# EAGLE design EXP430G2_node (EAGLE 8.2.2)
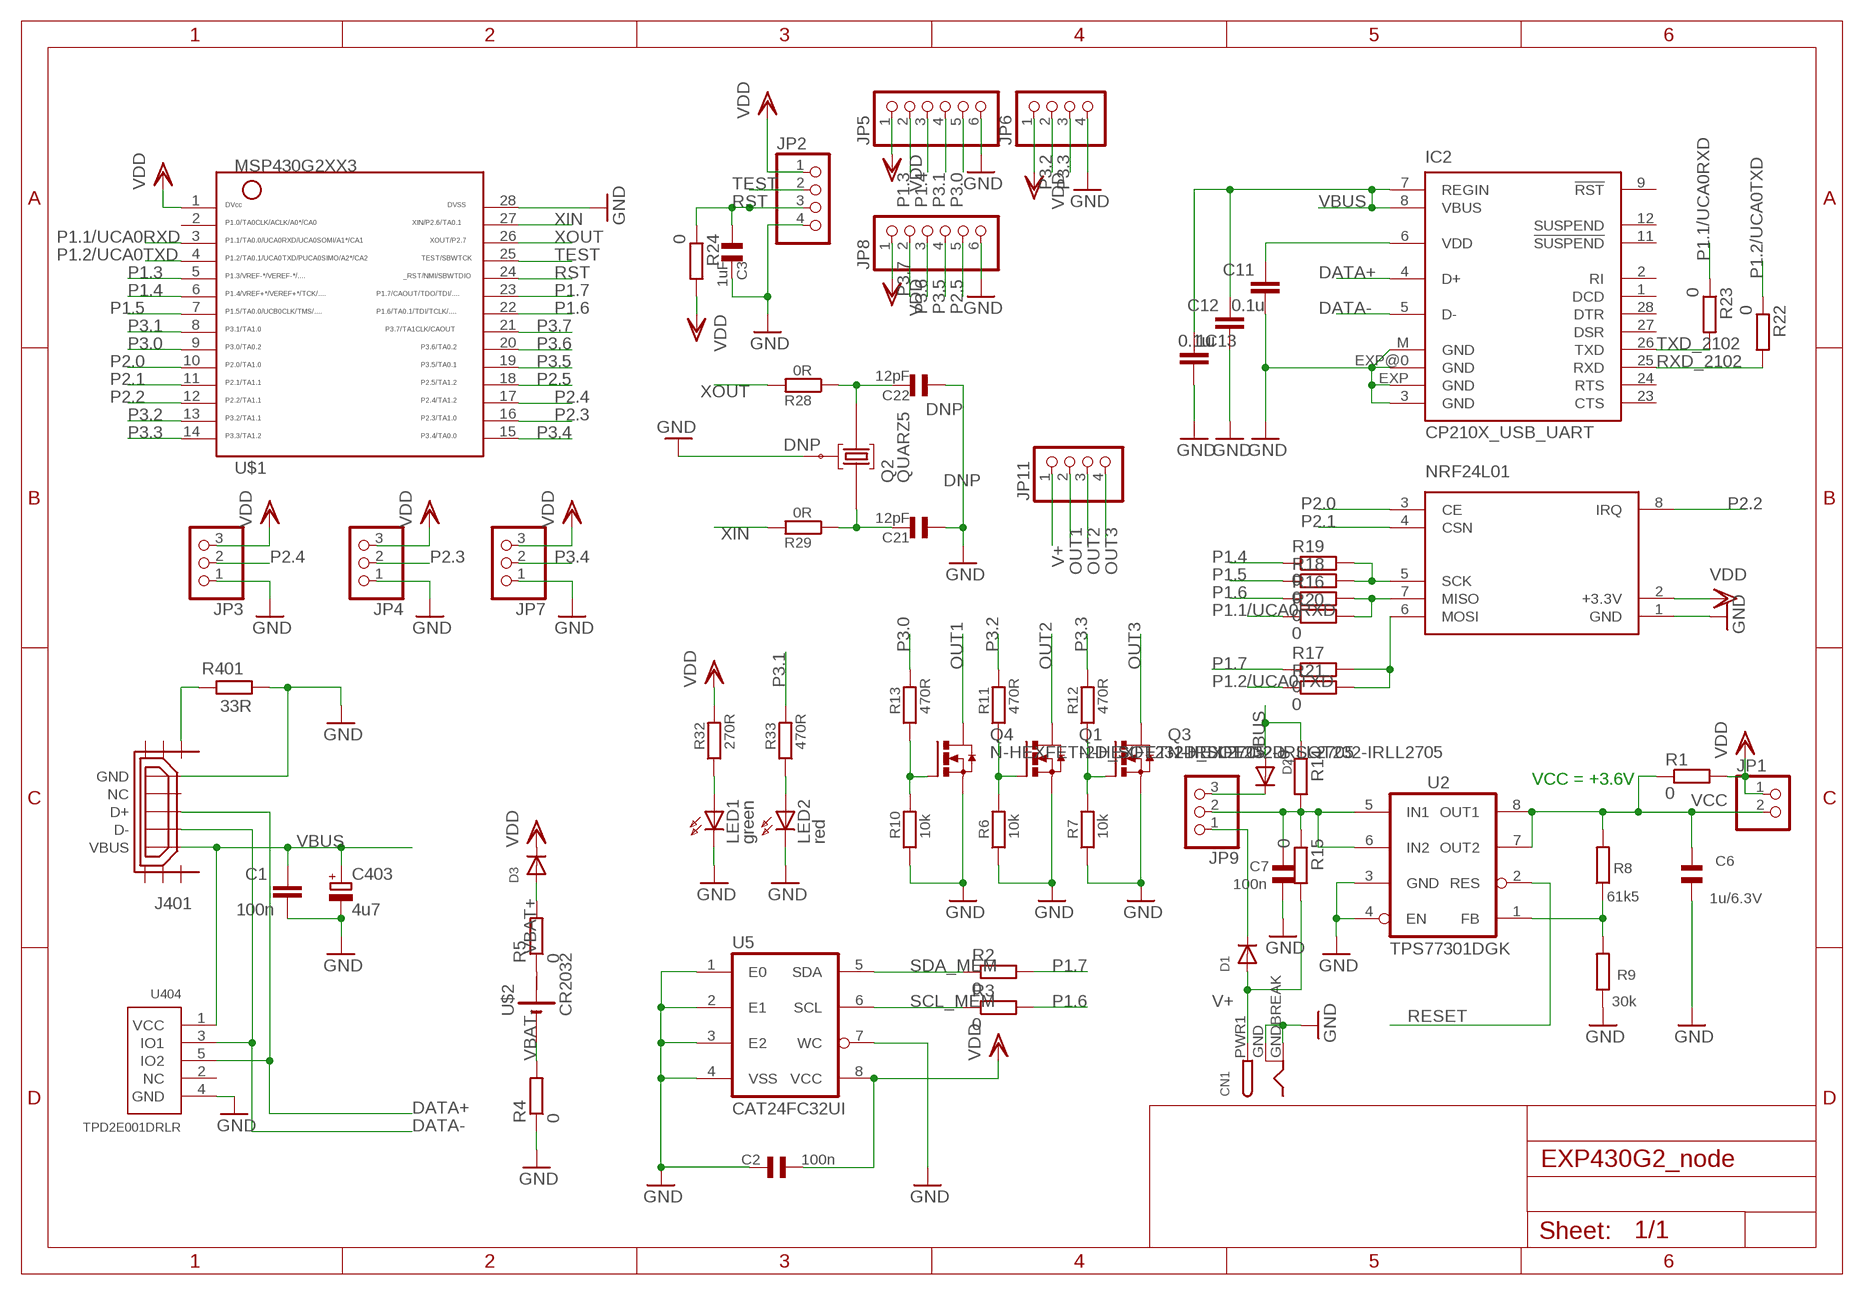
[diagram p0: schematic, sheet 1]

## Parts
C1  100n  C-EUC0603  [C0603]
C2  100n  C_SMD0603  [0603]
C3  1uF  C_SMD0603  [0603]
C6  1u/6.3V  C_SMD0603  [0603]
C7  100n  C_SMD0603  [0603]
C11  0.1u  C-EUC0603  [C0603]
C12  1u  C-EUC0603  [C0603]
C13  0.1u  C-EUC0603  [C0603]
C21  12pF  C_SMD0603  [0603]
C22  12pF  C_SMD0603  [0603]
C403  4u7  CPOL-EUA/3216-18R  [A/3216-18R]
CN1  DCBARRELSMT  [DCJACK_2MM_SMT]
D1  DIODESOT23_REFLOW  [SOT23-R]
D2  DIODESOT23_REFLOW  [SOT23-R]
D3  DIODESOT23_REFLOW  [SOT23-R]
IC2  CP210X_USB_UART  [MLP28]
J401  USB_MICRO_FLIPPED  [HIROSE-ZX62R-B-5P]
JP1  PINHD-1X2  [1X02]
JP2  PINHD-1X4  [1X04]
JP3  PINHD-1X3  [1X03]
JP4  PINHD-1X3_2.00  [1X03M]
JP5  PINHD-1X6_2.00  [1X06M]
JP6  PINHD-1X4_2.00  [1X04M]
JP7  PINHD-1X3  [1X03]
JP8  PINHD-1X6_2.00  [1X06M]
JP9  PINHD-1X3  [1X03]
JP11  PINHD-1X4_2.00  [1X04M]
LED1  green  LED_0603D0603  [DIODE0603]
LED2  red  LED_0603D0603  [DIODE0603]
NRF24L01  NRF24L01HP  [NRF24L01_HP]
Q1  N-HEXFET-2D_SOT232-IRLL2705  [SOT223]
Q2  QUARZ5  [QUARZ5]
Q3  N-HEXFET-2D_SOT232-IRLL2705  [SOT223]
Q4  N-HEXFET-2D_SOT232-IRLL2705  [SOT223]
R1  0  R-EU_R0201  [R0201]
R2  0  R-EU_R0201  [R0201]
R3  0  R-EU_R0201  [R0201]
R4  0  R-EU_R0201  [R0201]
R5  0  R-EU_R0201  [R0201]
R6  10k  R_SMDR0603  [0603]
R7  10k  R_SMDR0603  [0603]
R8  61k5  R_SMDR0603  [0603]
R9  30k  R_SMDR0603  [0603]
R10  10k  R_SMDR0603  [0603]
R11  470R  R_SMDR0603  [0603]
R12  470R  R_SMDR0603  [0603]
R13  470R  R_SMDR0603  [0603]
R14  0  R-EU_R0201  [R0201]
R15  0  R-EU_R0201  [R0201]
R16  0  R-EU_R0201  [R0201]
R17  0  R-EU_R0201  [R0201]
R18  0  R-EU_R0201  [R0201]
R19  0  R-EU_R0201  [R0201]
R20  0  R-EU_R0201  [R0201]
R21  0  R-EU_R0201  [R0201]
R22  0  R-EU_R0201  [R0201]
R23  0  R-EU_R0201  [R0201]
R24  0  R-EU_R0201  [R0201]
R28  0R  R_SMDR0603  [0603]
R29  0R  R_SMDR0603  [0603]
R32  270R  R_SMDR0603  [0603]
R33  470R  R_SMDR0603  [0603]
R401  33R  R-EU_R0603  [R0603]
U2  TPS77301DGK  TPS773XX  [MSOP8]
U5  CAT24FC32UI  M24XXX  [TSSOP8]
U404  TPD2E001DRLR  TPD2E001  [TPD2E001-DRL]
U$1  G2XX3---PW28  [PW28]
U$2  CR2032  [CR2032]

## Nets
DATA+: IC2.4(D+) J401.D+ U404.5(IO2)
DATA-: IC2.5(D-) J401.D- U404.3(IO1)
GND [Ground]: C1.2 C2.2 C3.2 C6.2 C7.1 C11.2 C12.2 C13.2 C21.1 C22.1 C403.- CN1.GND(GNDBREAK) CN1.GNDBREAK(GND) IC2.3(GND) IC2.EXP(GND) IC2.EXP@0(GND) IC2.M(GND) J401.GND JP2.4 JP3.1 JP4.1 JP5.6 JP6.4 JP7.1 JP8.6 LED1.K(C) LED2.K(C) NRF24L01.1(GND) Q1.3(S) Q2.GND@0 Q3.3(S) Q4.3(S) R4.1 R6.1 R7.1 R9.1 R10.1 R401.2 U2.3(GND) U2.4(EN) U5.1(E0) U5.2(E1) U5.3(E2) U5.4(VSS) U5.7(WC) U404.4(GND) U$1.28
N$1: C7.2 JP9.2 R14.2 R15.1 U2.5(IN1) U2.6(IN2)
N$2: D1.3(C) JP9.1
N$4: R8.1 R9.2 U2.1(FB)
N$5: D3.1(A) R5.2
N$6: Q1.1(G) R6.2 R11.1
N$7: NRF24L01.7(MISO) R16.2 R20.2
N$8: Q3.1(G) R7.2 R12.1
N$9: NRF24L01.6(MOSI) R17.2 R21.2
N$10: J401.SHIELD1 R401.1
N$11: Q4.1(G) R10.2 R13.1
N$12: NRF24L01.5(SCK) R18.2 R19.2
N$14: LED2.A R33.1
N$20: C11.1 IC2.6(VDD)
N$34: LED1.A R32.1
OUT1: JP11.2 Q4.2(D) Q4.4(D)
OUT2: JP11.3 Q1.2(D) Q1.4(D)
OUT3: JP11.4 Q3.2(D) Q3.4(D)
P1.1/UCA0RXD: R20.1 R23.1 U$1.3
P1.2/UCA0TXD: R21.1 R22.1 U$1.4
P1.3: JP5.2 U$1.5
P1.4: JP5.3 R19.1 U$1.6
P1.5: R18.1 U$1.7
P1.6: R3.2 R16.1 U$1.22
P1.7: R2.2 R17.1 U$1.23
P2.0: NRF24L01.3(CE) U$1.10
P2.1: NRF24L01.4(CSN) U$1.11
P2.2: NRF24L01.8(IRQ) U$1.12
P2.3: JP4.2 U$1.16
P2.4: JP3.2 U$1.17
P2.5: JP8.5 U$1.18
P3.0: JP5.5 R13.2 U$1.9
P3.1: JP5.4 R33.2 U$1.8
P3.2: JP6.2 R11.2 U$1.13
P3.3: JP6.3 R12.2 U$1.14
P3.4: JP7.2 U$1.15
P3.5: JP8.4 U$1.19
P3.6: JP8.3 U$1.20
P3.7: JP8.2 U$1.21
RESET: U2.2(RES)
RST: C3.1 JP2.3 R24.1 U$1.24
RXD_2102: IC2.25(RXD) R22.2
SCL_MEM: R3.1 U5.6(SCL)
SDA_MEM: R2.1 U5.5(SDA)
TEST: JP2.2 U$1.25
TXD_2102: IC2.26(TXD) R23.2
V+: CN1.PWR1(PWR) D1.1(A) JP11.1 R15.2
VBAT+: R5.1 U$2.P$1(+)
VBAT-: R4.2 U$2.P$2(-)
VBUS [Power]: C1.1 C12.1 C13.1 C403.+ D2.1(A) IC2.7(REGIN) IC2.8(VBUS) J401.VBUS R14.1 U404.1(VCC)
VBUS+ [Power]: D2.3(C) JP9.3
VCC: C6.1 JP1.2 R1.1 R8.2 U2.7(OUT2) U2.8(OUT1)
VDD: C2.1 D3.3(C) JP1.1 JP2.1 JP3.3 JP4.3 JP5.1 JP6.1 JP7.3 JP8.1 NRF24L01.2(+3.3V) R1.2 R24.2 R32.2 U5.8(VCC) U$1.1
XIN: R29.2 U$1.27
XINR: C21.2 Q2.2 R29.1
XOUT: R28.2 U$1.26
XOUTR: C22.2 Q2.1 R28.1
Unconnected: IC2.1(DCD) IC2.2(RI) IC2.9(!RST) IC2.11(!SUSPEND) IC2.12(SUSPEND) IC2.23(CTS) IC2.24(RTS) IC2.27(DSR) IC2.28(DTR) J401.NC J401.SHIELD2 J401.SHIELD3 J401.SHIELD4 J401.SHIELD5 J401.SHIELD6 U404.2(NC) U$1.2

## Notes on the sheet
- DNP
- DNP
- DNP
- VCC = +3.6V

## Library data of the parts
C1 C11-C13 = rcl:C-EU: CAPACITOR, European symbol
C2 C6 C7 = smd:C_SMD
C3 C21 C22 = ssmd:C_SMD
C403 = rcl:CPOL-EU: POLARIZED CAPACITOR, European symbol
CN1 = adafruit:DCBARREL: 2.0mm DC Barrel Jack DCJACK_2MM_PTH - Through Hole Jack (4UConnector: 05537)
D1-D3 = adafruit:DIODE: Diode SMADIODE - SMA Surface Mount Package 20V 1A Schottky Diode Digikey: 641-1014-6-ND DO-1N4148 - Through Hole Small Current Diode SOD-123 20V 1 A (.5mV Vf) Schottky Diode - Digikey: MBRX120TPMSCT-ND SOD-323 10V 570mA (.38mV Vf, 3ns) Schottky Diode - Digikey: ZLLS410CT-ND SOD-523 30V 30mA Schottky Diode (RB751S-40TE61) - Digikey: RB751S-40TE61CT-ND SOT23-R/W - SOT23 Package (R = Solder Paste/Reflow Ovens, W = Hand-Soldering) BAT54Film 40V 300mA - Digikey: 497-7162-1-ND
IC2 = SparkFun:CP210X_USB_UART: Single-Chip USB to UART Bridge Source: www.silabs.com .. CP2101.pdf / cp2102.pdf. Spark Fun Electronics SKU : COM-00310
J401 = usb_con-update:USB_MICRO_FLIPPED
JP1 = pinhead:PINHD-1X2: PIN HEADER
JP2 = pinhead:PINHD-1X4: PIN HEADER
JP3 = pinhead:PINHD-1X3: PIN HEADER
JP4 = pinhead_smd:PINHD-1X3: PIN HEADER
JP5 JP8 = pinhead_smd:PINHD-1X6: PIN HEADER
JP6 JP11 = pinhead_smd:PINHD-1X4: PIN HEADER
JP7 JP9 = adafruit:PINHD-1X3: PIN HEADER
LED1 LED2 = smd:LED_0603
NRF24L01 = jt-raspberry-pi:NRF24L01
Q1 Q3 Q4 = transistor-power:N-HEXFET-2D_?-*: HEXFET® Power MOSFET 2 Drain connects http://www.irf.com/product-info/datasheets/data/irll014n.pdf
Q2 = sMSP430:QUARZ5
R1-R5 R14-R24 = resistor:R-EU_: RESISTOR, European symbol
R6 R7 R10-R13 R28 R29 R32 R33 = ssmd:R_SMD
R8 R9 = smd:R_SMD
R401 = rcl:R-EU_: RESISTOR, European symbol
U2 = gangprog:TPS773XX: VReg, 250mA
U5 = usbfet:M24XXX: Serial EEProm: 24LC xxx
U404 = Project7264:TPD2E001: TPD2E001 ESD-protection diode array
U$1 = TI_MSP430_v16:G2XX3---PW28: MSP430G2XX1 TSSOP (PW) 28 Pin Package
U$2 = jt-raspberry-pi:CR2032

## Net classes
0 default: width 0.254 mm
1 Ground: width 0.1 mm, drill 0.2 mm
2 Power: width 0.203 mm, drill 0.305 mm, clearance 0.152 mm to class 0, clearance 0.152 mm to class 1, clearance 0.152 mm

## Board
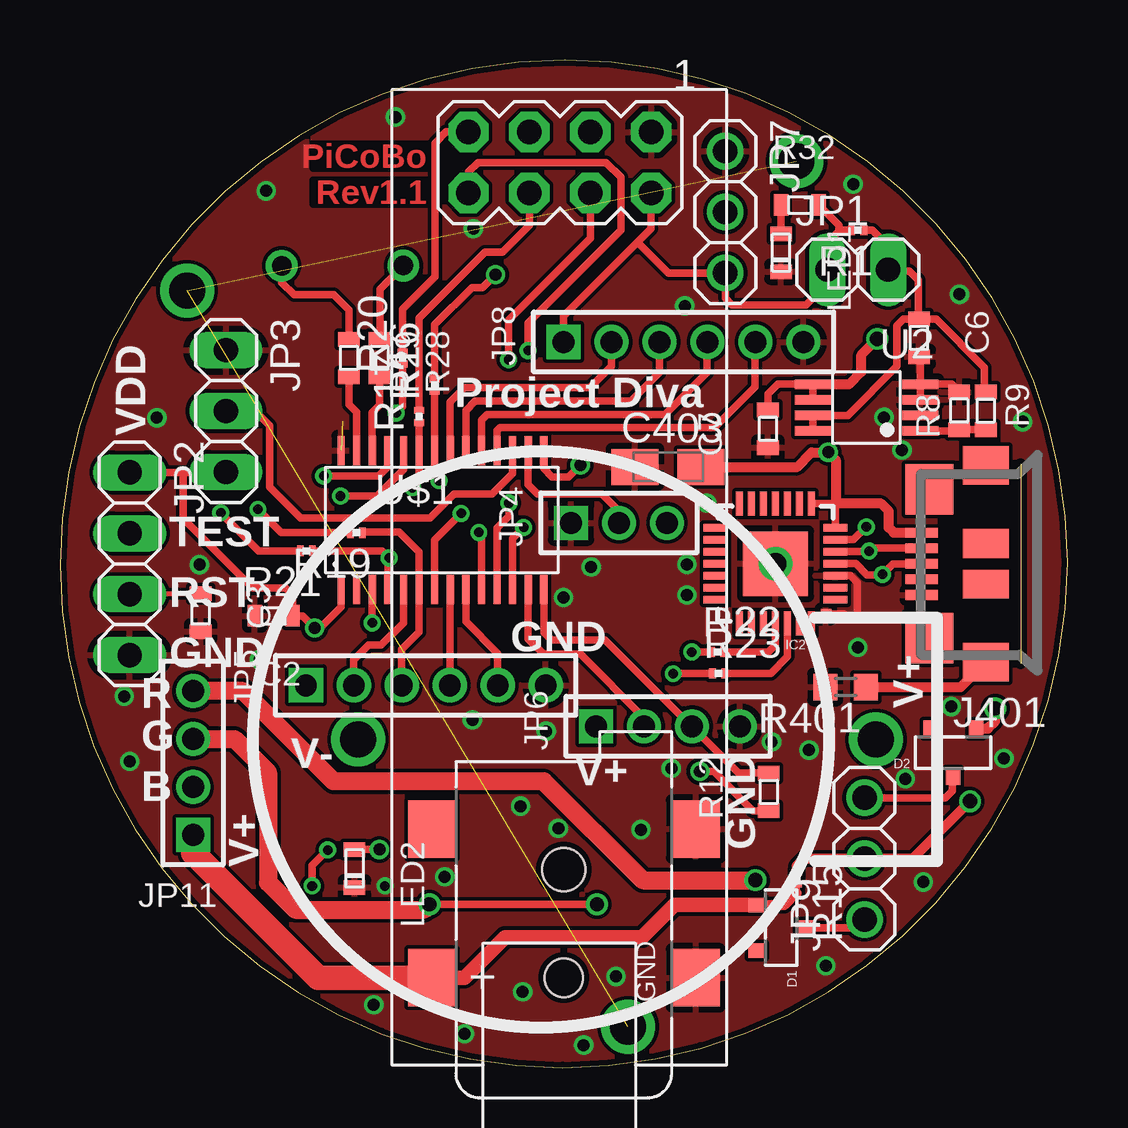
[diagram p1: board, top side]
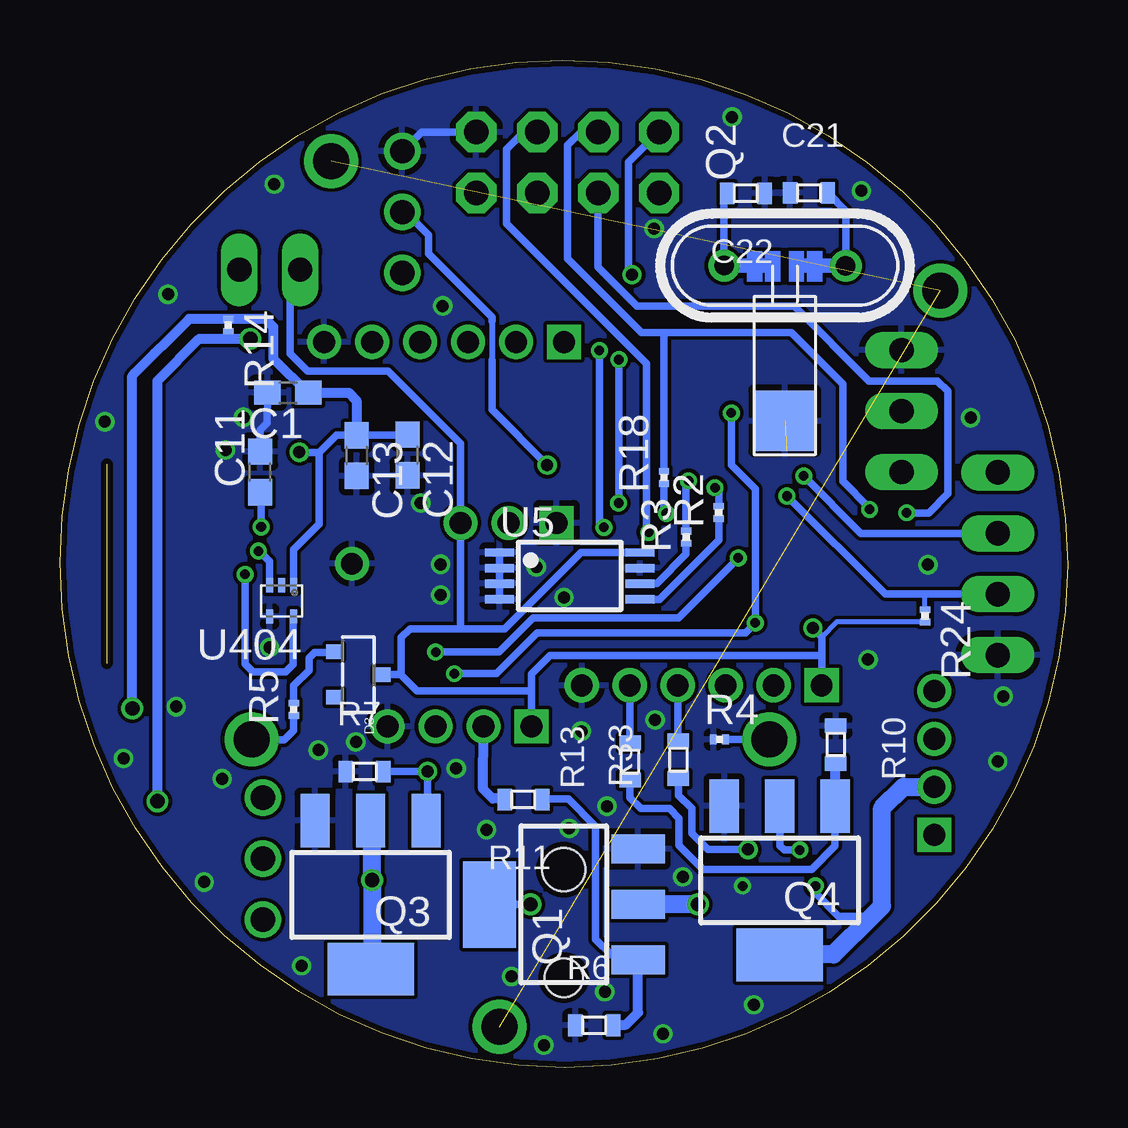
[diagram p2: board, bottom side, seen from below]

Size 42 x 42 mm. Coordinates in mm from the lower left corner, seen from the top.
Outline: 0,20.95 arc90 20.95,0 arc90 42,21.05 arc90 21.05,42 arc90 0,20.95
Copper layers (1*16): Top 0.035mm / dielectric 1.5mm / Bottom 0.035mm
Design rules "Elecrow_2-layer_eagle_rule": minimum track width 6mil, minimum drill 12mil, track to track 6mil, track to pad 6mil, pad to pad 6mil, via to via 6mil, smd to smd 0mil, copper to edge 10mil, drill to drill 10mil, minimum pad ring 10mil, minimum via ring 6mil, stop-mask expansion 2mil, vias tented up to drill 100mil, thermal gap 10mil

### Footprints (pad centres in the part's own frame; a part is rotated, then mirrored left to right if it is on the bottom)
C0603 = smd 1.1 x 1: 1 -0.85,0; 2 0.85,0
0603 = smd 0.6 x 0.9: 1 -0.787,0; 2 0.787,0
A/3216-18R = smd 1.95 x 1.5: + 1.375,0; - -1.375,0
DCJACK_2MM_SMT = smd 2.4 x 2: GND 0,-5.5; GNDBREAK 6.2,-5.5; PWR1 0,5.5; PWR2 6.2,5.5 | hole 1.6: 0,0 | hole 1.8: 4.5,0
SOT23-R = smd 0.6 x 0.7: 1 -0.95,-1; 2 0.95,-1; 3 0,1
MLP28 = smd 1 x 0.3: 1 -2.5,1.5; 2 -2.5,1; 3 -2.5,0.5; 4 -2.5,0; 5 -2.5,-0.5; 6 -2.5,-1; 7 -2.5,-1.5; 15 2.5,-1.5; 16 2.5,-1; 17 2.5,-0.5; 18 2.5,0; 19 2.5,0.5; 20 2.5,1; 21 2.5,1.5 | smd 0.3 x 1: 8 -1.5,-2.5; 9 -1,-2.5; 10 -0.5,-2.5; 11 0,-2.5; 12 0.5,-2.5; 13 1,-2.5; 14 1.5,-2.5; 22 1.5,2.5; 23 1,2.5; 24 0.5,2.5; 25 0,2.5; 26 -0.5,2.5; 27 -1,2.5; 28 -1.5,2.5 | smd 2.7 x 2.7: EXP 0,0 | drill 0.9: EXP@0 0,0 | smd 0.435 x 0.435: M -2.103,2.103
HIROSE-ZX62R-B-5P = smd 1.35 x 0.4: D+ 2.675,0; D- 2.675,-0.65; GND 2.675,1.3; NC 2.675,0.65; VBUS 2.675,-1.3 | smd 1.9 x 1.6: SHIELD1 0,4.1; SHIELD2 0,-4.1 | smd 2 x 2.1: SHIELD3 2.35,3.1; SHIELD4 2.35,-3.1 | smd 1.9 x 1.2: SHIELD5 0,0.85; SHIELD6 0,-0.85
1X02 = drill 1.016 long: 1 -1.27,0; 2 1.27,0
1X04 = drill 1.016 long: 1 -3.81,0; 2 -1.27,0; 3 1.27,0; 4 3.81,0
1X03 = drill 1.016 long: 1 -2.54,0; 2 0,0; 3 2.54,0
1X03M = drill 0.914 square: 1 -2,0 | drill 0.914: 2 0,0; 3 2,0
1X06M = drill 0.914 square: 1 -5,0 | drill 0.914: 2 -3,0; 3 -1,0; 4 1,0; 5 3,0; 6 5,0
1X04M = drill 0.914 square: 1 -3,0 | drill 0.914: 2 -1,0; 3 1,0; 4 3,0
1X03' = drill 1.016: 1 -2.54,0; 2 0,0; 3 2.54,0
DIODE0603 = smd 0.6 x 0.9: A -0.787,0; K 0.787,0
NRF24L01_HP = drill 1.016 pad 1.676 octagon: 1 13.485,-5.74; 2 10.945,-5.74; 3 13.485,-3.2; 4 10.945,-3.2; 5 13.485,-0.66; 6 10.945,-0.66; 7 13.485,1.88; 8 10.945,1.88
SOT223 = smd 1.219 x 2.235: 1 -2.311,-3.099; 2 0,-3.099; 3 2.311,-3.099 | smd 3.6 x 2.2: 4 0,3.099
QUARZ5 = drill 0.813: 1 1.53,1.773; 2 1.52,-3.303 | smd 2.54 x 2.54: GND@0 -4.941,-0.762
R0201 = smd 0.28 x 0.43: 1 -0.255,0; 2 0.255,0
R0603 = smd 1 x 1.1: 1 -0.85,0; 2 0.85,0
MSOP8 = smd 0.4 x 1.5: 1 -0.978,-2.3; 2 -0.333,-2.3; 3 0.323,-2.3; 4 0.968,-2.3; 5 0.968,2.18; 6 0.323,2.18; 7 -0.333,2.18; 8 -0.978,2.18
TSSOP8 = smd 1.2 x 0.35: 1 -2.925,0.975; 2 -2.925,0.325; 3 -2.925,-0.325; 4 -2.925,-0.975; 5 2.925,-0.975; 6 2.925,-0.325; 7 2.925,0.325; 8 2.925,0.975
TPD2E001-DRL = smd 0.3 x 0.6: 1 -0.5,-0.65; 2 0,-0.65; 3 0.5,-0.65; 4 0.5,0.65; 5 -0.5,0.65
PW28 = smd 0.3 x 1.2: 1 -4.229,-2.908; 2 -3.579,-2.908; 3 -2.929,-2.908; 4 -2.279,-2.908; 5 -1.629,-2.908; 6 -0.979,-2.908; 7 -0.329,-2.908; 8 0.321,-2.908; 9 0.971,-2.908; 10 1.621,-2.908; 11 2.271,-2.908; 12 2.921,-2.908; 13 3.571,-2.908; 14 4.221,-2.908; 15 4.221,2.892; 16 3.571,2.892; 17 2.921,2.892; 18 2.271,2.892; 19 1.621,2.892; 20 0.971,2.892; 21 0.321,2.892; 22 -0.329,2.892; 23 -0.979,2.892; 24 -1.629,2.892; 25 -2.279,2.892; 26 -2.929,2.892; 27 -3.579,2.892; 28 -4.229,2.892
CR2032 = drill 1.5: P$1 0,-13.97; P$2 0,7.62

### Placement (x,y rotation side)
C1  32.5,28.13 180 bottom
C2  8.91,18.83 180 top
C3  5.86,18.96 270 top
C6  35.81,30.41 270 top
C7  29.51,26.63 90 top
C11  33.65,24.83 90 bottom
C12  27.52,25.54 270 bottom
C13  29.63,25.51 270 bottom
C21  10.78,36.46 0 bottom
C22  13.41,36.45 180 bottom
C403  25.35,25.04 0 top
CN1  21,3.74 90 top
D1  30.06,5.83 270 top
D2  37.23,13.13 180 top
D3  29.56,16.38 270 bottom
IC2  29.83,21 180 top
J401  38.59,21 180 top
JP1  33.26,33.26 0 top
JP2  2.91,21 270 top
JP3  6.92,27.37 270 top
JP4  23.3,22.7 0 top
JP5  15.25,15.94 0 top
JP6  25.35,14.22 0 top
JP7  [1X03']  27.73,35.66 270 top
JP8  25.99,30.25 0 top
JP9  [1X03']  33.54,8.71 90 top
JP11  5.55,12.7 90 top
LED1  30.06,33.96 270 top
LED2  12.28,8.29 270 top
NRF24L01  18.91,25.51 90 top
Q1  21,6.8 90 bottom
Q2  12.54,31.9 90 bottom
Q3  29.05,7.2 180 bottom
Q4  12,7.8 180 bottom
R1  33.26,34.91 180 top
R2  14.54,23.14 90 bottom
R3  15.9,22.11 90 bottom
R4  14.51,13.67 0 bottom
R5  32.25,14.93 90 bottom
R6  19.73,1.76 0 bottom
R7  29.31,12.34 0 bottom
R8  38.59,27.38 90 top
R9  37.49,27.38 270 top
R10  9.66,13.46 270 bottom
R11  22.68,11.17 180 bottom
R12  29.55,11.49 90 top
R13  18.23,12.76 90 bottom
R14  34.99,30.95 270 bottom
R15  30.71,7.9 270 top
R16  15.62,28.44 90 top
R17  14.97,27.14 90 top
R18  16.82,24.6 90 bottom
R19  12.35,22.3 180 top
R20  14.28,29.57 90 top
R21  10.27,21.54 180 top
R22  27.42,17.32 0 top
R23  27.45,16.43 0 top
R24  5.94,18.83 270 bottom
R28  13.32,29.57 270 top
R29  12.05,29.57 270 top
R32  30.84,35.95 0 top
R33  16.23,12.84 90 bottom
R401  32.75,15.86 180 top
U2  33.56,27.52 90 top
U5  20.75,20.49 0 bottom
U404  32.76,19.45 180 bottom
U$1  15.95,22.83 0 top
U$2  20.05,13.67 90 top

### Tracks (layer width: path | path; a pad name or v marks a point on that pad's centre or on a via)
DATA+  (via drill 0.4)
  Top 0.305: IC2.4 33.17,21 33.64,20.53 34.26,20.53 v34.29,20.56 34.73,21 J401.D+
  Bottom 0.305: v34.29,20.56 34.29,16.82 33.94,16.48 32.6,16.48 32.28,16.8 32.28,18.79 U404.5
DATA-  (via drill 0.4)
  Top 0.305: J401.D- 35.9,21.66 33.83,21.66 v33.73,21.52 33.72,21.51 IC2.5
  Bottom 0.305: U404.3 33.26,21.1 33.69,21.52 v33.73,21.52
GND  (via drill 0.4, 0.5)  (1 unrouted)
  Top 0.305: R9.1 37.17,28.48 U2.4 U2.3 35.86,29.57 C6.2 | IC2.3 32.95,20.5 33.23,20.21 33.23,18.83 U404.4 | IC2.M 32.69,18.9 32.71,18.88
  Bottom 0.305: U5.1 U5.2 U5.3 U5.4 | NRF24L01.1 26.94,39 JP7.1 | C11.2 33.66,25.69 33.66,26.57 33.36,26.87 C1.2
  other vias: 20.27,14.02 22.15,20.86 29.66,13.57 26.13,19.69 20.99,19.59 26.04,31.75 34.35,27.1 8.32,17 2.68,15.48 5.81,20.96 33.26,17.51 13.55,7.57 17.23,34.97 13.98,39.62 8.59,36.55 33.07,36.83 37.5,32.23 40.13,26.92 39.35,12.89 35.99,7.73 31.92,4.24 21.83,0.94 16.86,1.41 13.08,2.61 24.22,9.92 4.04,27.09 2.91,12.76 26.96,23.53 20.77,9.97 19.2,10.89 16.04,7.95 19.29,3.16 23.17,3.79 17.19,14.49 26.13,20.98 35.1,25.74 37.16,15.05 35.24,12.04 31.23,13.23 25.49,12.47
  pour Bottom: -1,43 43,43 43,-1 -1,-1
  pour Top: -1,43 43,43 43,-1 -1,-1
N$1  (via drill 0.6)
  Top 0.305: U2.5 U2.6 | 31.4,28.47 U2.5 | R15.1 30.7,8.4 | U2.5 29.93,28.5 29.51,28.08 C7.2
  Top 0.406: 31.4,28.47 32.88,28.47 33.41,29.01 33.41,29.72 v34.07,30.38 | v37.93,11.1 35.54,8.71 JP9.2 31.01,8.71 30.7,8.4
  Bottom 0.305: R14.2 34.98,30.39 34.97,30.38
  Bottom 0.406: v37.93,11.1 37.93,28.64 36.19,30.38 34.97,30.38 v34.07,30.38
N$2
  Top 0.305: D1.3 33.19,5.83 JP9.1
N$3  (via drill 1.5)  (2 unrouted)
  other vias: 5.29,32.38 23.68,1.7 30.71,37.78
N$4
  Top 0.305: U2.1 37.34,26.54 R9.2 R8.1
N$5
  Bottom 0.305: R5.2 32.25,15.92 31.62,16.56 31.62,17.07 31.38,17.31 30.59,17.31 D3.1
N$6
  Bottom 0.305: 21.87,11.2 20.81,11.2 19.67,10.05 19.67,5.34 19.02,4.69 Q1.1
  Bottom 0.406: R6.2 18.92,1.79 18.4,1.79 17.9,2.29 Q1.1 | R11.1 21.87,11.2
N$7  (via drill 0.5)
  Top 0.305: R20.2 14.28,31.62 15.63,32.97 15.63,38.54 16.1,39.01 17.01,39.01 NRF24L01.7 | R16.2 15.62,30.96 17.17,32.51 17.61,32.51 v18.16,33.05
  Bottom 0.305: v18.16,33.05 18.31,33.21 18.31,37.74 17.05,39 NRF24L01.7
N$8  (via drill 0.5)
  Top 0.305: R12.1 28.89,10.7 27.25,12.34 v26.68,12.34
  Bottom 0.305: 26.69,10.3 Q3.1 26.68,10.31 v26.68,12.34 R7.2
N$9  (via drill 0.4)
  Top 0.305: R17.2 14.97,31.24 17.73,33.99 18.45,33.99 19.57,35.11 NRF24L01.6 19.54,36.43 | R21.2 8.29,21.54 v6.7,23.12
  Bottom 0.305: v6.7,23.12 5.79,23.12 4.99,23.92 4.99,28.19 5.42,28.62 8.28,28.62 11.39,31.73 17.94,31.73 19.57,33.36 NRF24L01.6
N$10
  Top 0.406: R401.1 37.55,15.86 J401.SHIELD1
N$11
  Bottom 0.305: 9.66,10.87 Q4.1 | R13.1 18.23,11.24 17.79,10.79 16.6,10.79 16.19,10.38 16.19,9.26 15.2,8.26 10.66,8.26 9.69,9.24 Q4.1 | Q4.1
  Bottom 0.406: R10.2 9.69,12.64 Q4.1
N$12  (via drill 0.4)
  Top 0.305: R19.2 9.22,22.3 v8.25,23.26
  Bottom 0.305: v8.25,23.26 8.25,23.33 9.37,24.44 9.37,28.48 11.52,30.63 16.76,30.63 | 16.76,30.63 17.75,30.63 20.84,33.72 20.84,38.45 20.29,39 NRF24L01.5 | R18.2 16.82,30.57 16.76,30.63
N$14  (via drill 0.5)
  Top 0.305: v13.32,9.09 LED2.A
  Bottom 0.305: R33.1 16.21,12.04 16.21,11.35 15.66,10.79 15.66,9.75 14.99,9.09 v13.32,9.09
N$20  (via drill 0.4)
  Top 0.305: IC2.6 33.08,22 v33.61,22.54
  Bottom 0.305: 33.47,24 C11.1 33.61,23.94 v33.61,22.54
N$34
  Top 0.305: LED1.A R32.1
OUT1  (via drill 0.4)
  Top 0.305: v11.16,9.06 10.51,8.42 v10.51,7.57
  Bottom 0.305: Q4.2 11.99,10.88 11.99,9.24 11.81,9.06 v11.16,9.06 | 8.15,6.31 9.55,6.31 10.51,7.27 v10.51,7.57
  Bottom 0.61: Q4.4
  Bottom 0.75: Q4.4 9.75,4.71 8.15,6.31 7.73,6.73 7.73,10.82 6.84,11.71 JP11.2
OUT2  (via drill 0.6)
  Top 0.305: v22.39,6.8 v15.4,6.8
  Top 0.75: JP11.3 7.28,13.7 8.67,12.3 8.67,7.72 9.81,6.58 15.17,6.58 v15.4,6.8
  Bottom 0.305: Q1.4 v22.39,6.8
  Bottom 0.75: v15.4,6.8 Q1.2
OUT3  (via drill 0.6)
  Top 0.75: v28.99,7.81 24.29,7.81 20.16,11.94 11.4,11.94 7.64,15.7 JP11.4
  Bottom 0.406: 29,4.15 Q3.4
  Bottom 0.61: 29,10.25 Q3.2
  Bottom 0.75: Q3.2 28.99,10.24 v28.99,7.81 28.99,4.16 Q3.4
P1.1/UCA0RXD  (via drill 0.4)
  Top 0.305: U$1.3 v13.02,18.54 v13.01,18.54 | v25.56,16.42 25.57,16.43 R23.1 | v14.02,27.29 14.28,27.56 R20.1
  Bottom 0.305: v25.56,16.42 23.81,16.42 22.11,18.12 13.43,18.12 v13.01,18.54 13.01,24.11 14.02,25.12 v14.02,27.29
P1.2/UCA0TXD  (via drill 0.4)
  Top 0.305: v26.34,17.32 R22.1 | R21.1 13.43,21.54 v13.72,21.24 13.67,21.19 U$1.4
  Bottom 0.305: 26.06,17.32 v26.34,17.32 23.71,17.32 22.29,18.74 16.23,18.74 v13.72,21.24
P1.3
  Top 0.305: JP5.2 12.25,16.99 12.87,17.61 13.39,17.61 14.32,18.54 U$1.5
P1.4
  Top 0.305: JP5.3 14.25,17.44 14.97,18.16 U$1.6 14.97,21.49 14.13,22.32 12.63,22.32 R19.1
P1.5  (via drill 0.4)
  Top 0.305: U$1.7 15.62,21.99 v16.72,23.1
  Bottom 0.305: v16.72,23.1 16.82,23.2 R18.1
P1.6  (via drill 0.4)
  Top 0.305: v15.8,24.46 15.62,24.75 U$1.22 R16.1
  Bottom 0.305: v15.8,24.46 15.9,24.39 R3.2
P1.7  (via drill 0.4)
  Top 0.305: v14.69,24.17 14.97,24.44 U$1.23 R17.1
  Bottom 0.305: R2.2 14.54,24.01 v14.69,24.17
P2.0  (via drill 0.4)
  Top 0.305: U$1.10 17.57,22.2 v17.46,22.31
  Bottom 0.305: NRF24L01.3 22.67,39 23.38,38.29 23.38,35.18 17.55,29.35 17.55,22.4 v17.46,22.31
P2.1  (via drill 0.4)
  Top 0.305: NRF24L01.4 22.11,34.57 18.69,31.15 18.7,31.14 v18.7,29.51 | U$1.11 18.22,22.49 18.72,22.98 v18.72,23.53
  Bottom 0.305: v18.7,29.51 18.7,23.54 v18.72,23.53
P2.2  (via drill 0.4)
  Top 0.305: NRF24L01.8 17.03,37.33 17.42,37.73 22.75,37.73 23.38,37.11 23.38,34.9 19.52,31.04 v19.52,29.89 | v19.33,22.51 18.87,22.06 U$1.12
  Bottom 0.305: v19.52,29.89 19.52,22.7 v19.33,22.51
P2.3
  Top 0.305: U$1.16 19.52,24.3 19.91,23.91 22.59,23.91 23.3,23.2 JP4.2
P2.4
  Top 0.305: U$1.17 18.87,24.76 18.02,23.91 16.43,23.91 15.43,22.91 10.03,22.91 8.75,24.19 8.75,26.76 8.14,27.36 JP3.2
P2.5
  Top 0.305: U$1.18 18.22,26.55 18.35,26.68 27.29,26.68 28.98,28.37 28.98,30.23 JP8.5
P3.0
  Top 0.305: U$1.9 16.92,18.6 18.25,17.27 JP5.5
  Bottom 0.305: R13.2 18.25,14.48 JP5.5
P3.1
  Top 0.305: U$1.8 16.27,15.96 JP5.4
  Bottom 0.305: JP5.4 16.25,13.65 R33.2
P3.2
  Top 0.305: JP6.2 24.36,14.56 21.69,17.23 20.15,17.23 19.52,17.86 U$1.13
  Bottom 0.406: R11.2 23.5,11.21 23.96,11.21 24.36,11.61 JP6.2
P3.3
  Top 0.305: U$1.14 20.17,18.14 20.49,17.82 22.72,17.82 26.36,14.17 JP6.3 28.29,12.28 R12.2
P3.4  (via drill 0.5)
  Top 0.305: U$1.15 20.17,24.96 20.51,24.62 21.19,24.62 v21.69,25.12
  Bottom 0.254: 24,31.11 24,29.5
  Bottom 0.305: v21.69,25.12 24,27.43 24,29.5 | 24,31.11 24,31.29 26.63,33.92 26.63,34.71 27.58,35.66 JP7.2
P3.5
  Top 0.305: U$1.19 17.57,26.99 17.8,27.23 25.22,27.23 26.96,28.96 26.96,30.21 JP8.4
P3.6
  Top 0.305: U$1.20 16.92,27.38 17.31,27.77 23.8,27.77 24.99,28.96 JP8.3
P3.7
  Top 0.305: U$1.21 16.27,27.75 16.86,28.34 22.09,28.34 23,29.25 JP8.2
RST  (via drill 0.4)
  Top 0.203: C3.1 2.92,19.75 JP2.3
  Top 0.305: U$1.24 14.32,24.92 13.22,23.82 v11.69,23.82
  Bottom 0.203: R24.1 5.94,19.7 5.97,19.73
  Bottom 0.305: JP2.3 5.97,19.73 7.6,19.73 v11.69,23.82
RXD_2102
  Top 0.305: R22.2 29.54,17.32 29.83,17.61 IC2.25
SCL_MEM
  Bottom 0.305: R3.1 15.9,21.4 17.12,20.17 U5.6
SDA_MEM
  Bottom 0.305: U5.5 17,19.52 14.54,21.98 R2.1
TEST  (via drill 0.4)
  Top 0.305: U$1.25 13.67,25.05 13.28,24.66 v10.99,24.66
  Bottom 0.305: JP2.2 8.61,22.27 v10.99,24.66
TXD_2102
  Top 0.305: IC2.26 30.33,17.13 29.63,16.43 R23.2
V+
  Top 0.305: 29.07,6.77 D1.1 | 30.7,7.27 R15.2 | 29.03,6.8 D1.1 | 29.02,6.82 D1.1 | 15.47,3.77 CN1.PWR1
  Top 0.406: 30.7,7.27 30.2,6.77 29.07,6.77
  Top 0.61: D1.1 25.61,6.78 24.27,5.43 18.55,5.43 16.86,3.74 CN1.PWR1
  Top 1.016: CN1.PWR1 10.75,3.74 5.55,8.95 JP11.1
VBAT+
  Bottom 0.305: U$2.P$1 34.01,13.66 32.65,13.66 32.25,14.06 R5.1
VBAT-
  Bottom 0.305: R4.2 U$2.P$2
VBUS  (via drill 0.5, 0.6)
  Top 0.305: IC2.8 32.33,23.5 | 32.33,23.5 IC2.7 | 32.34,23.52 32.33,23.5 | 32.01,25.64 v32.03,25.65
  Top 0.406: J401.VBUS 34.76,22.3 34.55,22.5 34.55,23.19 34.24,23.5 32.33,23.5 | D2.1 38.68,14.13 38.99,14.44 v38.99,14.97 | v32.03,25.65 32.34,25.33 32.34,23.52 | C403.+ 30.73,25.04 31.33,25.64 32.01,25.64
  Bottom 0.305: U404.1 32.26,21.58 31.19,22.66 31.19,25.64 | 31.19,25.64 30.46,26.36 C13.1 | 31.68,28.13 C1.1 | 31.19,25.64 32.01,25.64 v32.03,25.65 | 29.64,26.37 C13.1 | C12.1 27.54,26.36 C13.1
  Bottom 0.406: v38.99,14.97 38.99,28.84 36.62,31.2 R14.1 33.44,31.2 33.11,30.87 33.11,29.55 31.68,28.13 | C1.1 29.96,28.13 29.64,27.81 29.64,26.37
VBUS+
  Top 0.305: JP9.3 36.92,11.25 37.21,11.54 37.21,12.1 D2.3
VCC
  Top 0.305: U2.8 U2.7 32.84,27.18 34.88,29.23 34.88,30.92 35.15,31.19 35.8,31.19 C6.1 | R8.2 38.54,28.22 38.54,29.18 36.52,31.2 C6.1 | R1.1 33.85,34.91 34.53,34.24 JP1.2 | JP1.2 34.53,33.09 | C6.1 35.77,31.24 35.77,32.83 35.4,33.19 34.59,33.19 JP1.2
VDD  (via drill 0.5)
  Top 0.305: R1.2 32.99,34.9 32.5,34.9 32.46,34.87 | 32.46,34.87 31.99,34.39 JP1.1 31.99,32.69 31.09,31.79 28.01,31.79 27.73,32.06 JP7.3 25.36,33.12 24.07,34.41 | R32.2 32.46,35.12 32.46,34.87 | 24.66,36.44 NRF24L01.2 24.64,36.44 24.64,34.97 24.07,34.41 | JP2.1 5.13,24.81 | 5.13,24.81 6.9,24.81 JP3.3 | U$1.1 11.72,19.2 10.84,18.32 v10.61,18.32 10.11,18.83 C2.1 9.7,19.71 9.41,20 8.02,20 5.13,22.89 5.13,24.81 | JP8.1 20.99,31.33 24.07,34.41
  Bottom 0.203: R24.2 9.63,18.58 10.25,17.96
  Bottom 0.305: U5.8 20.28,21.47 23.47,18.29 25.36,18.29 | 25.36,18.29 25.3,18.34 JP4.3 25.3,26.01 28.32,29.03 31.68,29.03 32.41,29.75 32.41,32.36 31.99,32.77 JP1.1 | 22.35,15.71 27.12,15.71 27.8,16.38 | JP5.1 10.25,17.18 | v10.61,18.32 10.25,17.96 10.25,17.18 | 22.35,15.71 22.35,16.41 21.57,17.18 10.25,17.18 | 22.35,15.71 JP6.1 | D3.3 27.8,16.38 | 27.8,16.38 27.77,16.41 27.77,17.93 27.42,18.29 25.36,18.29
XIN
  Top 0.305: U$1.27 12.37,27.32 12.05,27.64 R29.2
XINR
  Top 0.305: R29.1 12.06,30.38 12.06,31.57 11.41,32.22 9.75,32.22 9.24,32.73 Q2.2
  Bottom 0.305: C21.2 9.24,35.71 Q2.2
XOUT
  Top 0.305: 13.29,28.76 R28.2 13.32,27.61 13.02,27.31 U$1.26
XOUTR
  Top 0.305: R28.1 13.34,30.39 13.34,32.46 Q2.1
  Bottom 0.305: 14.37,33.37 Q2.1 14.32,36.32 C22.2

### Text on the board
Top: PiCoBo | Rev1.1
tNames: Project Diva | VDD | TEST | RST | GND | GND | V+ | R | V- | G | GND | V+ | B | V+